# EasyEDA schematic 1-Schematic_AU9560-SC-Reader.json
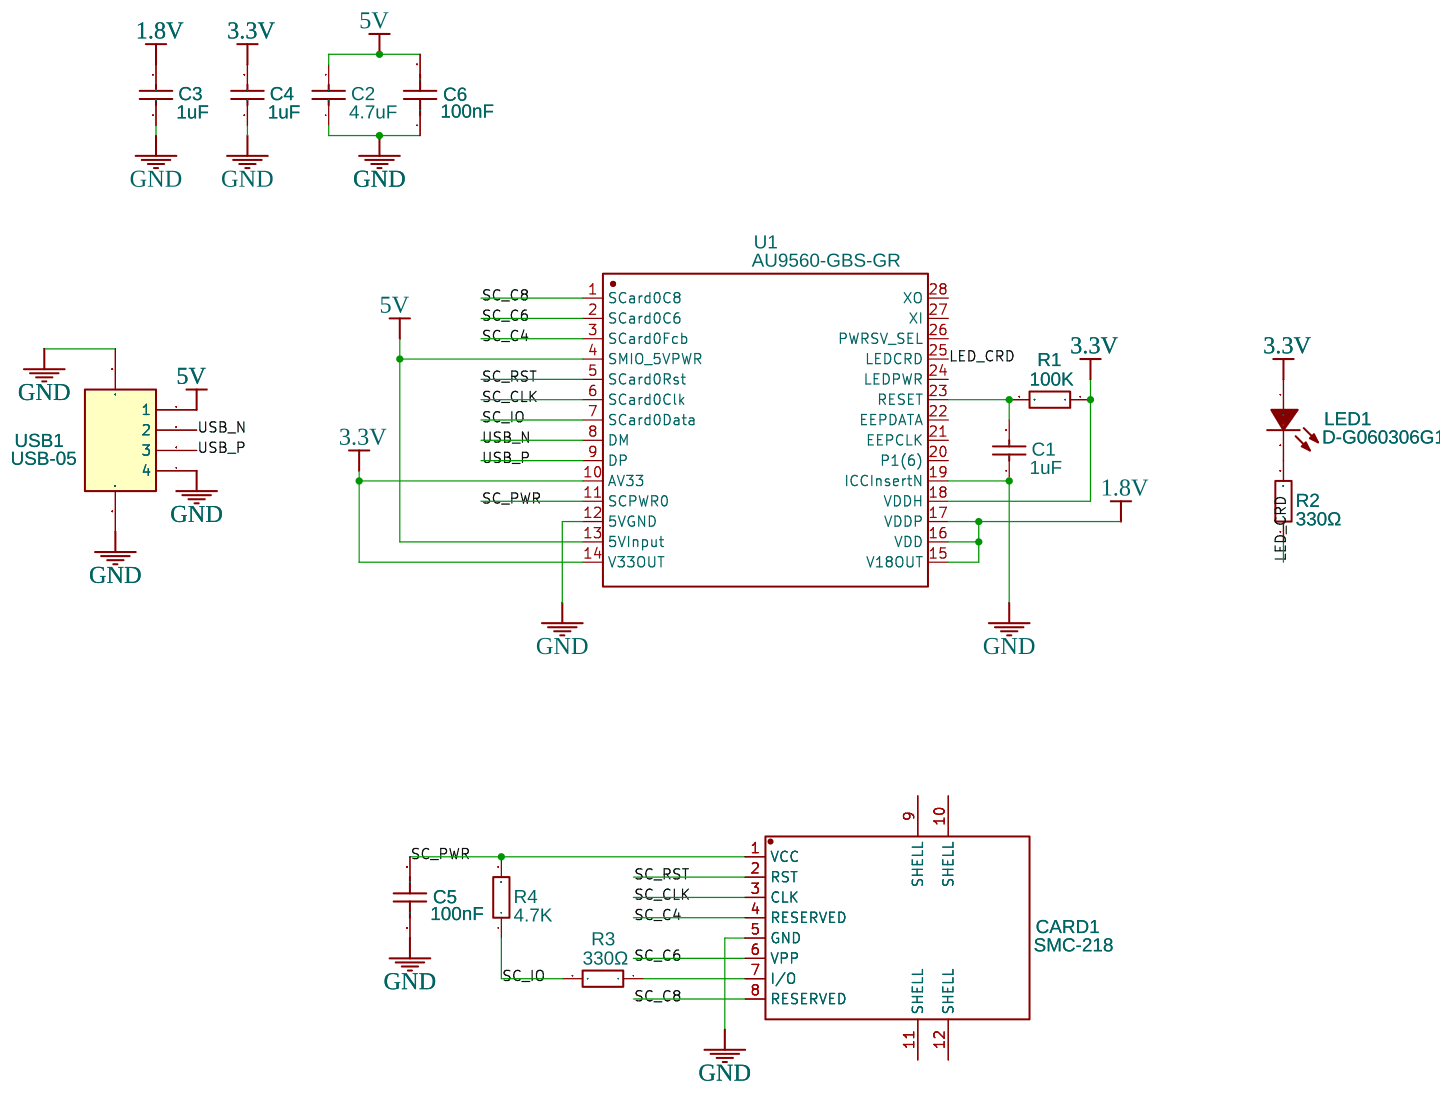
[diagram p0: schematic sheet]

## Parts
C1  1uF  [0603]
C2  4.7uF  [0603]
C3  1uF  [0603]
C4  1uF  [0603]
C5  100nF  [0603]
C6  100nF  [0603]
CARD1  SMC-218  [SMC-218]
LED1  D-G060306G1-KS2  [LED_0603]
R1  100K  [0603]
R2  330Ω  [0603]
R3  330Ω  [0603]
R4  4.7K  [0603]
U1  AU9560-GBS-GR  [SSOP-28_208MIL]
USB1  USB-05  [USB-M-48]

## Library data of the parts
C1-C4 = CL10A475KO8NNNC: Supplier: LCSC; Manufacturer: SAMSUNG; LCSC Assembly: Yes; SMT Type: Basic
C5 C6 = CC0603KRX7R9BB104: Supplier: LCSC; Manufacturer: YAGEO; LCSC Assembly: Yes; SMT Type: Basic
CARD1 = -: Supplier: LCSC; Supplier Part: C266885; Manufacturer: XUNPU; Contributor: LCSC
LED1 = -: Supplier: LCSC; Supplier Part: C118334; Manufacturer: Wuxi ARK Tech Elec; Contributor: LCSC; LCSC Assembly: Yes; SMT Type: Extend
R1 = TC0325B1002T5E: Supplier: LCSC; Manufacturer: UniOhm; LCSC Assembly: Yes; SMT Type: Extend
R2 R4 = TC0350F4701T5E_C179829: Supplier: LCSC; Manufacturer: Uniroyal Elec; Contributor: LCSC; LCSC Assembly: Yes; SMT Type: Extend
R3 = 0603WAF1210T5E: Supplier: LCSC; Manufacturer: UniOhm; LCSC Assembly: Yes; SMT Type: Extend
U1 = -: Supplier: LCSC; Manufacturer: ALCOR MICRO; Contributor: LCSC; Supplier Part: C126999
USB1 = -: Supplier: LCSC; Manufacturer: SOFNG; Contributor: LCSC; Supplier Part: C112454

## Nets
1.8V: C3.2 U1.15(V18OUT) U1.16(VDD) U1.17(VDDP)
3.3V: C4.2 LED1.1(A) R1.1 U1.10(AV33) U1.14(V33OUT) U1.18(VDDH)
5V: C2.2 C6.2 U1.4(SMIO_5VPWR) U1.13(5VInput) USB1.1
GND: C1.1 C2.1 C3.1 C4.1 C5.1 C6.1 CARD1.5(GND) U1.12(5VGND) U1.19(ICCInsertN) USB1.0 USB1.4 USB1.6
LED_CRD: R2.1 U1.25(LEDCRD)
SC_C4: CARD1.4(RESERVED) U1.3(SCard0Fcb)
SC_C6: CARD1.6(VPP) U1.2(SCard0C6)
SC_C8: CARD1.8(RESERVED) U1.1(SCard0C8)
SC_CLK: CARD1.3(CLK) U1.6(SCard0Clk)
SC_IO: R3.2 R4.1 U1.7(SCard0Data)
SC_PWR: C5.2 CARD1.1(VCC) R4.2 U1.11(SCPWR0)
SC_RST: CARD1.2(RST) U1.5(SCard0Rst)
USB_N: U1.8(DM) USB1.2
USB_P: U1.9(DP) USB1.3
Net-(C1-2): C1.2 R1.2 U1.23(RESET)
Net-(CARD1-7): CARD1.7(I/O) R3.1
Net-(LED1-2): LED1.2(K) R2.2

Not connected (* = marked no-connect by the designer): CARD1 9(SHELL) 10(SHELL) 11(SHELL) 12(SHELL); U1 20(P1(6)) 21(EEPCLK) 22(EEPDATA) 24(LEDPWR) 26(PWRSV_SEL) 27(XI) 28(XO)
